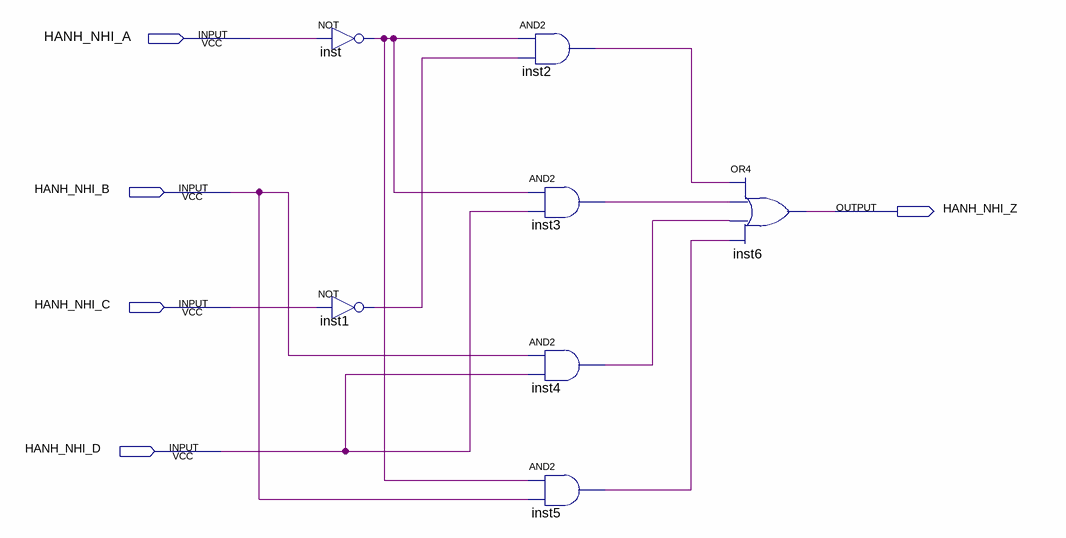
[diagram p0: schematic sheet]
// Quartus schematic Assignment5b.bdf as structural Verilog: 7 symbols, 5 pins
module Assignment5b (
  input  HANH_NHI_A,
  input  HANH_NHI_B,
  input  HANH_NHI_C,
  input  HANH_NHI_D,
  output HANH_NHI_Z
);

  wire inst1_out, inst2_out, inst3_out, inst4_out, inst5_out, inst_out;

  not inst (inst_out, HANH_NHI_A);
  not inst1 (inst1_out, HANH_NHI_C);
  and inst2 (inst2_out, inst_out, inst1_out);
  and inst3 (inst3_out, inst_out, HANH_NHI_D);
  and inst4 (inst4_out, HANH_NHI_B, HANH_NHI_D);
  and inst5 (inst5_out, inst_out, HANH_NHI_B);
  or inst6 (HANH_NHI_Z, inst2_out, inst3_out, inst4_out, inst5_out);
endmodule
